# Altium schematic sheet DAC.SchDoc: DAC
size A4; DocumentNumber: 8; Revision: 2.0; SheetNumber: 8; SheetTotal: 18
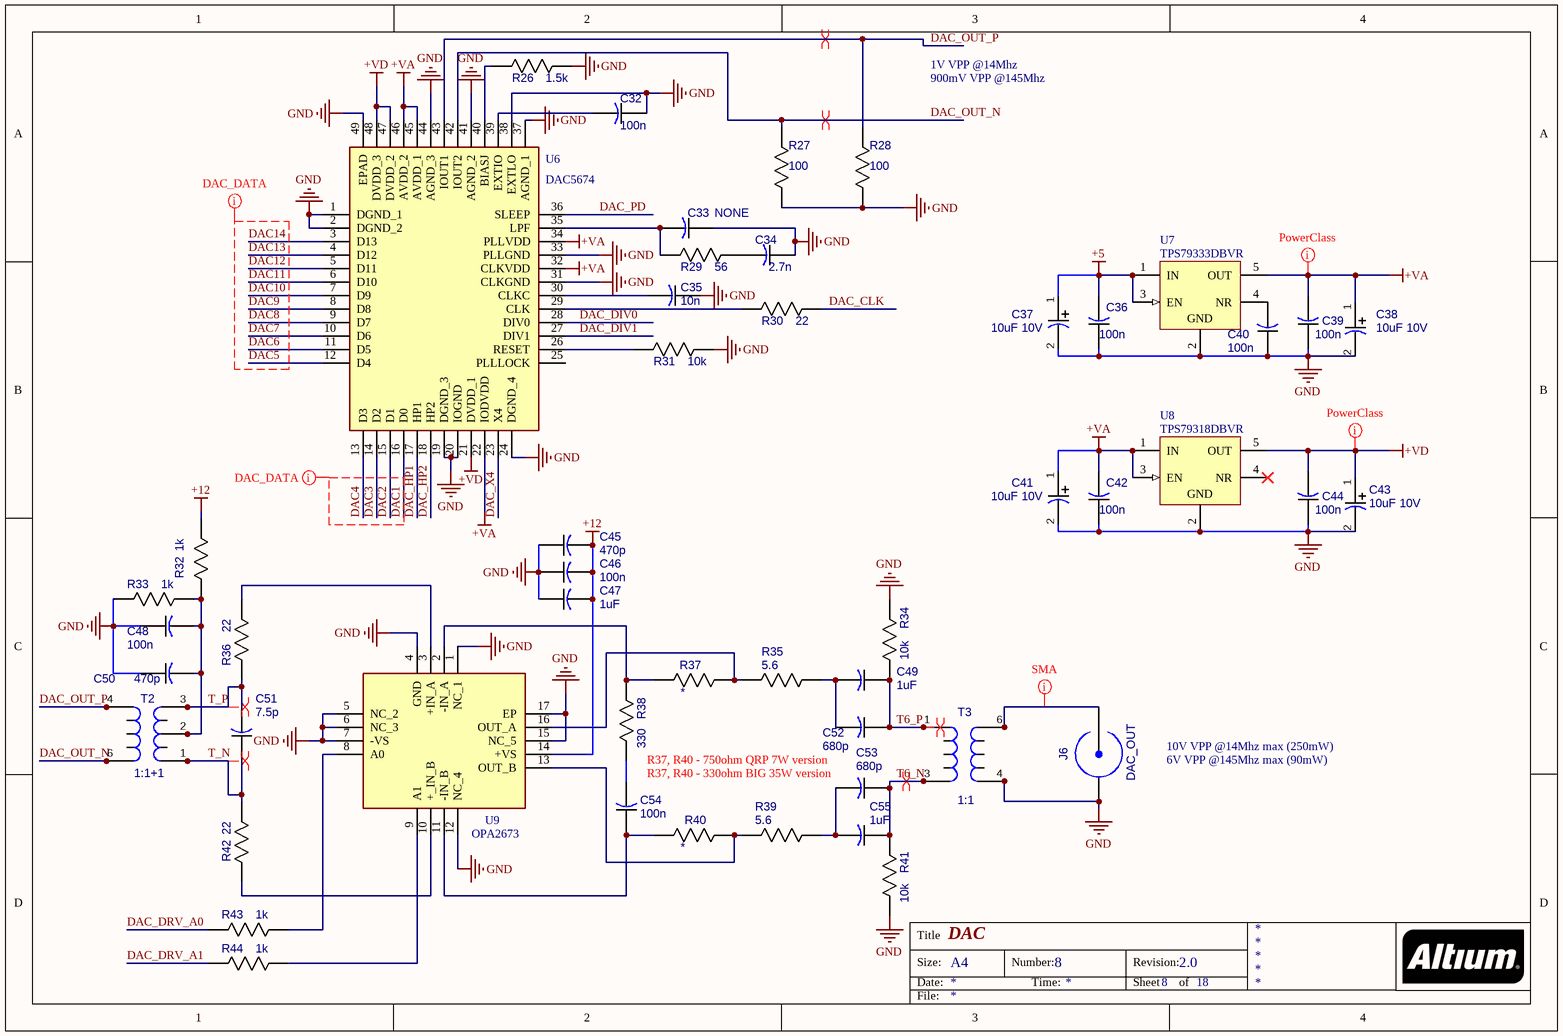
[diagram p0: DAC.SchDoc]

## Parts
C32  100n  [CAP_0805]
C33  NONE  [CAP_0805]
C34  2.7n  [CAP_0805]
C35  10n  [CAP_0805]
C36  100n  [CAP_0805]
C37  10uF 10V  [CAPAE_4.3x4.3h5.4]
C38  10uF 10V  [CAPAE_4.3x4.3h5.4]
C39  100n  [CAP_0805]
C40  100n  [CAP_0805]
C41  10uF 10V  [CAPAE_4.3x4.3h5.4]
C42  100n  [CAP_0805]
C43  10uF 10V  [CAPAE_4.3x4.3h5.4]
C44  100n  [CAP_0805]
C45  470p  [CAP_0805]
C46  100n  [CAP_0805]
C47  1uF  [CAP_0805]
C48  100n  [CAP_0805]
C49  1uF  [CAP_1206]
C50  470p  [CAP_0805]
C51  7.5p  [CAP_0805]
C52  680p  [CAP_1206]
C53  680p  [CAP_1206]
C54  100n  [CAP_0805]
C55  1uF  [CAP_1206]
J6  DAC_OUT  [31-5431]
R26  1.5k  [RES_0805]
R27  100  [RES_0805]
R28  100  [RES_0805]
R29  56  [RES_0805]
R30  22  [RES_0805]
R31  10k  [RES_0805]
R32  1k  [RES_0805]
R33  1k  [RES_0805]
R34  10k  [RES_0805]
R35  5.6  [RES_1206]
R36  22  [RES_0805]
R37  *  [RES_0805]
R38  330  [RES_0805]
R39  5.6  [RES_1206]
R40  *  [RES_0805]
R41  10k  [RES_0805]
R42  22  [RES_0805]
R43  1k  [RES_0805]
R44  1k  [RES_0805]
T2  1:1+1  [TRANSF_ACORE2]
T3  1:1  [TRANSF_ACORE]
U6  DAC5674  [QFP50P900X900X100-49N]
U7  TPS79333DBVR  [DBV0005A_L]
U8  TPS79318DBVR  [DBV0005A_L]
U9  OPA2673  [QFN65P400X400X100-17N-D]

## Nets
+5: C36.2 C37.1(PLUS) U7.1(IN) U7.3(EN)
+12: C45.2 C46.2 C47.2 R32.2 U9.14(+VS)
+VA: C38.1(PLUS) C39.2 C41.1(PLUS) C42.2 U6.22(IODVDD) U6.32(CLKVDD) U6.34(PLLVDD) U6.45(AVDD_1) U6.46(AVDD_2) U7.5(OUT) U8.1(IN) U8.3(EN)
+VD: C43.1(PLUS) C44.2 U6.21(DVDD_1) U6.47(DVDD_2) U6.48(DVDD_3) U8.5(OUT)
GND: C32.1 C33.1 C34.1 C35.1 C36.1 C37.2(MINUS) C38.2(MINUS) C39.1 C40.1 C41.2(MINUS) C42.1 C43.2(MINUS) C44.1 C45.1 C46.1 C47.1 C48.1 C50.1 J6.1(GND) J6.2(GND) J6.3(GND) J6.4(GND) R26.1 R27.1 R28.1 R31.1 R33.2 R34.1 R41.2 T3.4(S2) T3.11 U6.1(DGND_1) U6.2(DGND_2) U6.19(DGND_3) U6.20(IOGND) U6.24(DGND_4) U6.31(CLKGND) U6.33(PLLGND) U6.37(AGND_1) U6.38(EXTLO) U6.41(AGND_2) U6.44(AGND_3) U6.49(EPAD) U7.2(GND) U8.2(GND) U9.1(NC_1) U9.4(GND) U9.5(NC_2) U9.6(NC_3) U9.7(-VS) U9.12(NC_4) U9.15(NC_5) U9.17(EP)
DAC1: U6.16(D0)
DAC2: U6.15(D1)
DAC3: U6.14(D2)
DAC4: U6.13(D3)
DAC5: U6.12(D4)
DAC6: U6.11(D5)
DAC7: U6.10(D6)
DAC8: U6.9(D7)
DAC9: U6.8(D8)
DAC10: U6.7(D9)
DAC11: U6.6(D10)
DAC12: U6.5(D11)
DAC13: U6.4(D12)
DAC14: U6.3(D13)
DAC_CLK: R30.1
DAC_DIV0: U6.28(DIV0)
DAC_DIV1: U6.27(DIV1)
DAC_DRV_A0: R43.1
DAC_DRV_A1: R44.1
DAC_HP1: U6.17(HP1)
DAC_HP2: U6.18(HP2)
DAC_OUT_N: R27.2 T2.6(P2) T2.10 U6.42(IOUT2)
DAC_OUT_P: R28.2 T2.4(P1) T2.11 U6.43(IOUT1)
DAC_PD: U6.36(SLEEP)
DAC_X4: U6.23(X4)
T6_N: C53.1 C55.1 R41.1 T3.3(P2) T3.9
T6_P: C49.1 C52.1 R34.2 T3.1(P1) T3.7
T_N: C51.1 R42.2 T2.1(S3) T2.7
T_P: C51.2 R36.1 T2.3(S1) T2.9
NetC32_2: C32.2 U6.39(EXTIO)
NetC33_2: C33.2 R29.2 U6.35(LPF)
NetC34_2: C34.2 R29.1
NetC35_2: C35.2 U6.30(CLKC)
NetC40_2: C40.2 U7.4(NR)
NetC48_2: C48.2 C50.2 R32.1 R33.1 T2.2(S2) T2.8
NetC49_2: C49.2 C52.2 R35.1
NetC53_2: C53.2 C55.2 R39.1
NetC54_1: C54.1 R40.2 U9.11(-IN_B)
NetC54_2: C54.2 R38.2
NetJ6_5: J6.5(CON) T3.6(S1) T3.10
NetR26_2: R26.2 U6.40(BIASJ)
NetR30_2: R30.2 U6.29(CLK)
NetR31_2: R31.2 U6.26(RESET)
NetR35_2: R35.2 R37.1 U9.16(OUT_A)
NetR36_2: R36.2 U9.3(+IN_A)
NetR37_2: R37.2 R38.1 U9.2(-IN_A)
NetR39_2: R39.2 R40.1 U9.13(OUT_B)
NetR42_1: R42.1 U9.10(+_IN_B)
NetR43_2: R43.2 U9.8(A0)
NetR44_2: R44.2 U9.9(A1)

Not connected (* = marked no-connect by the designer): T3 8(0); U6 25(PLLLOCK); U8 4(NR)*

## Layout directives
rule Width Constraint [Pref Impedance = 50.00ohms    Min Impedance = 50.00ohms    Max Impedance = 50.00ohms]: NetJ6_5
differential pair: DAC_OUT_N, DAC_OUT_P, T6_N, T6_P, T_N, T_P
net class PowerPads: +VA, +VD
net class DAC_DATA: DAC1, DAC2, DAC3, DAC4, DAC5, DAC6, DAC7, DAC8, DAC9, DAC10, DAC11, DAC12, DAC13, DAC14

## Notes on the sheet
- 1V VPP @14Mhz
- 900mV VPP @145Mhz
- R37, R40 - 750ohm QRP 7W version
- (near C53) R37, R40 - 330ohm BIG 35W version
- 10V VPP @14Mhz max (250mW)
- 6V VPP @145Mhz max (90mW)
- Title
- Size:
- Date:
- A4
- Number:
- Time:
- Revision:
- Sheet
- of
- File:

## Library data of the parts
C32-C36 C39 C40 C42 C44-C48 C50 C51 C54 = CAP_0805
  C36 C39 C40 C42 C44 C46 C48 C54: Value: 100n
  C45 C50: Value: 470p
  C47: Value: 1uF
C37 C38 C41 C43 = CAPAE_4.3x4.3h5.4: Value: 10uF 10V
C49 C52 C53 C55 = CAP_1206
  C49 C55: Value: 1uF
  C52 C53: Value: 680p
J6 = 31-5431: SMA; Value: DAC_OUT
R26-R34 R36-R38 R40-R44 = RES_0805
  R32 R33: Value: 1k
  R34 R41: Value: 10k
  R36 R42: Value: 22
  R38: Value: 330
R35 R39 = RES_1206: Value: 5.6
T2 = TRANSF_ACORE2: Transformer; Value: 1:1+1
T3 = TRANSF_ACORE: Transformer; Value: 1:1
U6 = DAC5674IPHP: Integrated Circuit; Manufacturer_Name: Texas Instruments; Datasheet Link: https://www.ti.com/lit/ds/symlink/dac5674.pdf; Height: 1mm; Manufacturer_Part_Number: DAC5674IPHP
U7 = CMP-0394-00364-2: Single Output High PSRR LDO, 200 mA, Fixed 3.3 V Output, 2.7 to 5.5 V Input, 5-pin SOT-23 (DBV), -40 to 85 degC, Green (RoHS & no Sb/Br); Manufacturer: Texas Instruments; Iout(Max)(A): 0.2; Rating: Catalog; Vin(Min)(V): 2.7; Vdo(Typ)(mV): 102; Fixed Output Options(V): 3.3; Accuracy(%): 2; SubFamily: Single Channel LDO; Vin(Max)(V): 5.5; ComponentLink1URL: http://www.ti.com/; ComponentLink2URL: http://www.ti.com/general/docs/lit/getliterature.tsp?genericPartNumber=TPS79333&fileType=pdf; ComponentLink1Description: Manufacturer URL; PackageDescription: 5-Pin Plastic Small Outline, Body 1.60 Ãƒâ€” 2.90 mm, Pitch 0.95 mm; ComponentLink3URL: http://www.ti.com/litv/pdf/mpds018i; ComponentLink2Description: Datasheet; Mounting Technology: Surface Mount; ComponentLink3Description: Package Specification; PackageReference: DBV0005A; Code_JEDEC: MO-178; PartNumber: TPS79333DBVR; Vout Adj(Min)(V): 3.3; DatasheetVersion: SLVS348K; Eco-Plan: Green (RoHS & no Sb/Br); PackageVersion: 4073253-4/K; Vout Adj(Max)(V): 3.3; Iq(Typ)(mA): 0.2
U8 = CMP-0394-00328-2: Single Output High PSRR LDO, 200 mA, Fixed 1.8 V Output, 2.7 to 5.5 V Input, 5-pin SOT-23 (DBV), -40 to 85 degC, Green (RoHS & no Sb/Br); Manufacturer: Texas Instruments; Vdo(Typ)(mV): 112; SubFamily: Single Channel LDO; Iq(Typ)(mA): 0.2; Vin(Max)(V): 5.5; Accuracy(%): 2; Rating: Catalog; Vin(Min)(V): 2.7; Vout Adj(Max)(V): 1.8; ComponentLink3URL: http://www.ti.com/litv/pdf/mpds018i; PackageVersion: 4073253-4/K; Eco-Plan: Green (RoHS & no Sb/Br); ComponentLink3Description: Package Specification; PackageDescription: 5-Pin Plastic Small Outline, Body 1.60 Ãƒâ€” 2.90 mm, Pitch 0.95 mm; Mounting Technology: Surface Mount; DatasheetVersion: SLVS348K; PartNumber: TPS79318DBVR; ComponentLink1Description: Manufacturer URL; ComponentLink2Description: Datasheet; PackageReference: DBV0005A; Iout(Max)(A): 0.2; Fixed Output Options(V): 1.8; Vout Adj(Min)(V): 1.8; Code_JEDEC: MO-178; ComponentLink1URL: http://www.ti.com/; ComponentLink2URL: http://www.ti.com/general/docs/lit/getliterature.tsp?genericPartNumber=TPS79318&fileType=pdf
U9 = OPA2673IRGVT: Integrated Circuit; Manufacturer_Name: Texas Instruments; Datasheet Link: http://www.ti.com/lit/gpn/opa2673; Height: 1mm; Manufacturer_Part_Number: OPA2673IRGVT; Mouser Part Number: 595-OPA2673IRGVT; Mouser Price/Stock: https://www.mouser.co.uk/ProductDetail/Texas-Instruments/OPA2673IRGVT?qs=xHCJPbHdANbeLKV0FJjs6g%3D%3D; RS Part Number: 8122587P; RS Price/Stock: http://uk.rs-online.com/web/p/products/8122587P